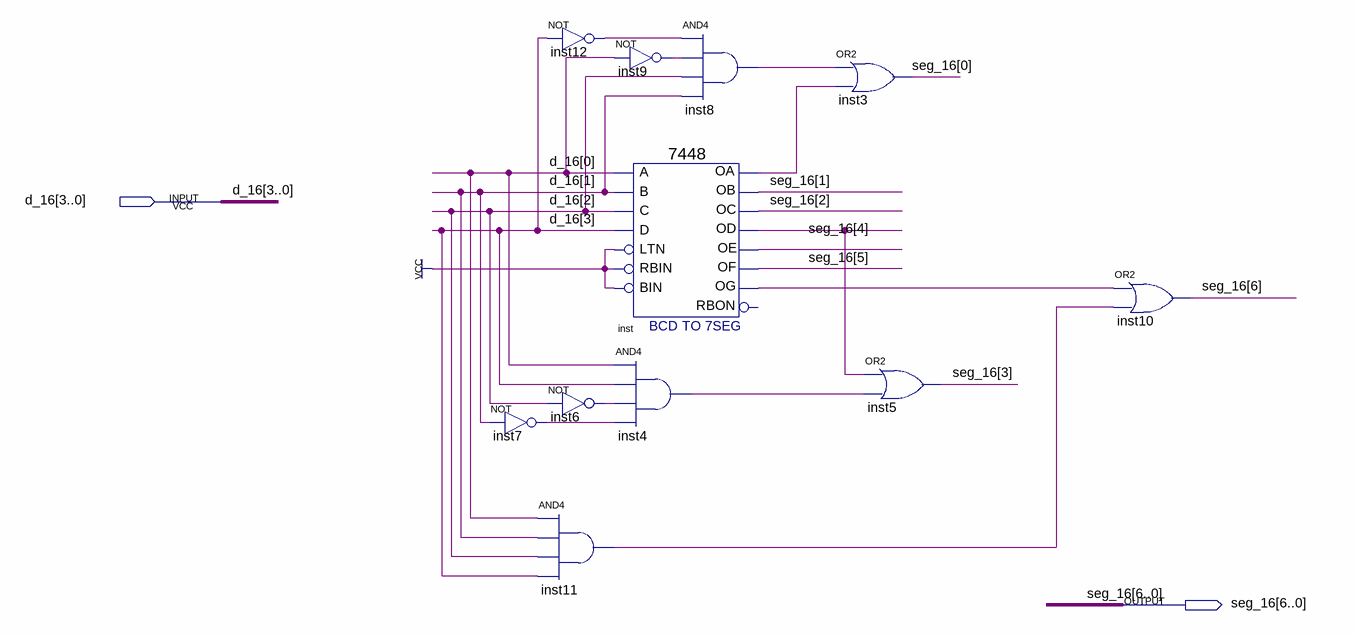
[diagram p0: schematic sheet]
// Quartus schematic code_select.bdf as structural Verilog: 11 symbols, 2 pins
module code_select (
  input  [3:0] d_16,
  output [6:0] seg_16
);

  wire inst4_out, inst6_out, inst7_out, inst8_out, inst9_out, inst11_out, inst12_out, inst_oa, inst_od,
       inst_og;

  not inst12 (inst12_out, d_16[3]);
  not inst6 (inst6_out, d_16[2]);
  not inst7 (inst7_out, d_16[1]);
  and inst11 (inst11_out, d_16[0], d_16[1], d_16[2], d_16[3]);
  not inst9 (inst9_out, d_16[0]);
  \7448  inst (
    .A(d_16[0]), .C(d_16[2]), .D(d_16[3]), .B(d_16[1]), .RBIN(1'b1), .BIN(1'b1), .LTN(1'b1), .OC(seg_16[2]),
    .OE(seg_16[4]), .OD(inst_od), .OF(seg_16[5]), .OG(inst_og), .OB(seg_16[1]), .OA(inst_oa));  // open: RBON
  and inst4 (inst4_out, d_16[0], d_16[3], inst6_out, inst7_out);
  and inst8 (inst8_out, inst12_out, inst9_out, d_16[2], d_16[1]);
  or inst3 (seg_16[0], inst8_out, inst_oa);
  or inst5 (seg_16[3], inst_od, inst4_out);
  or inst10 (seg_16[6], inst_og, inst11_out);
endmodule
